# EAGLE design auxiliary (EAGLE 9.1.0)
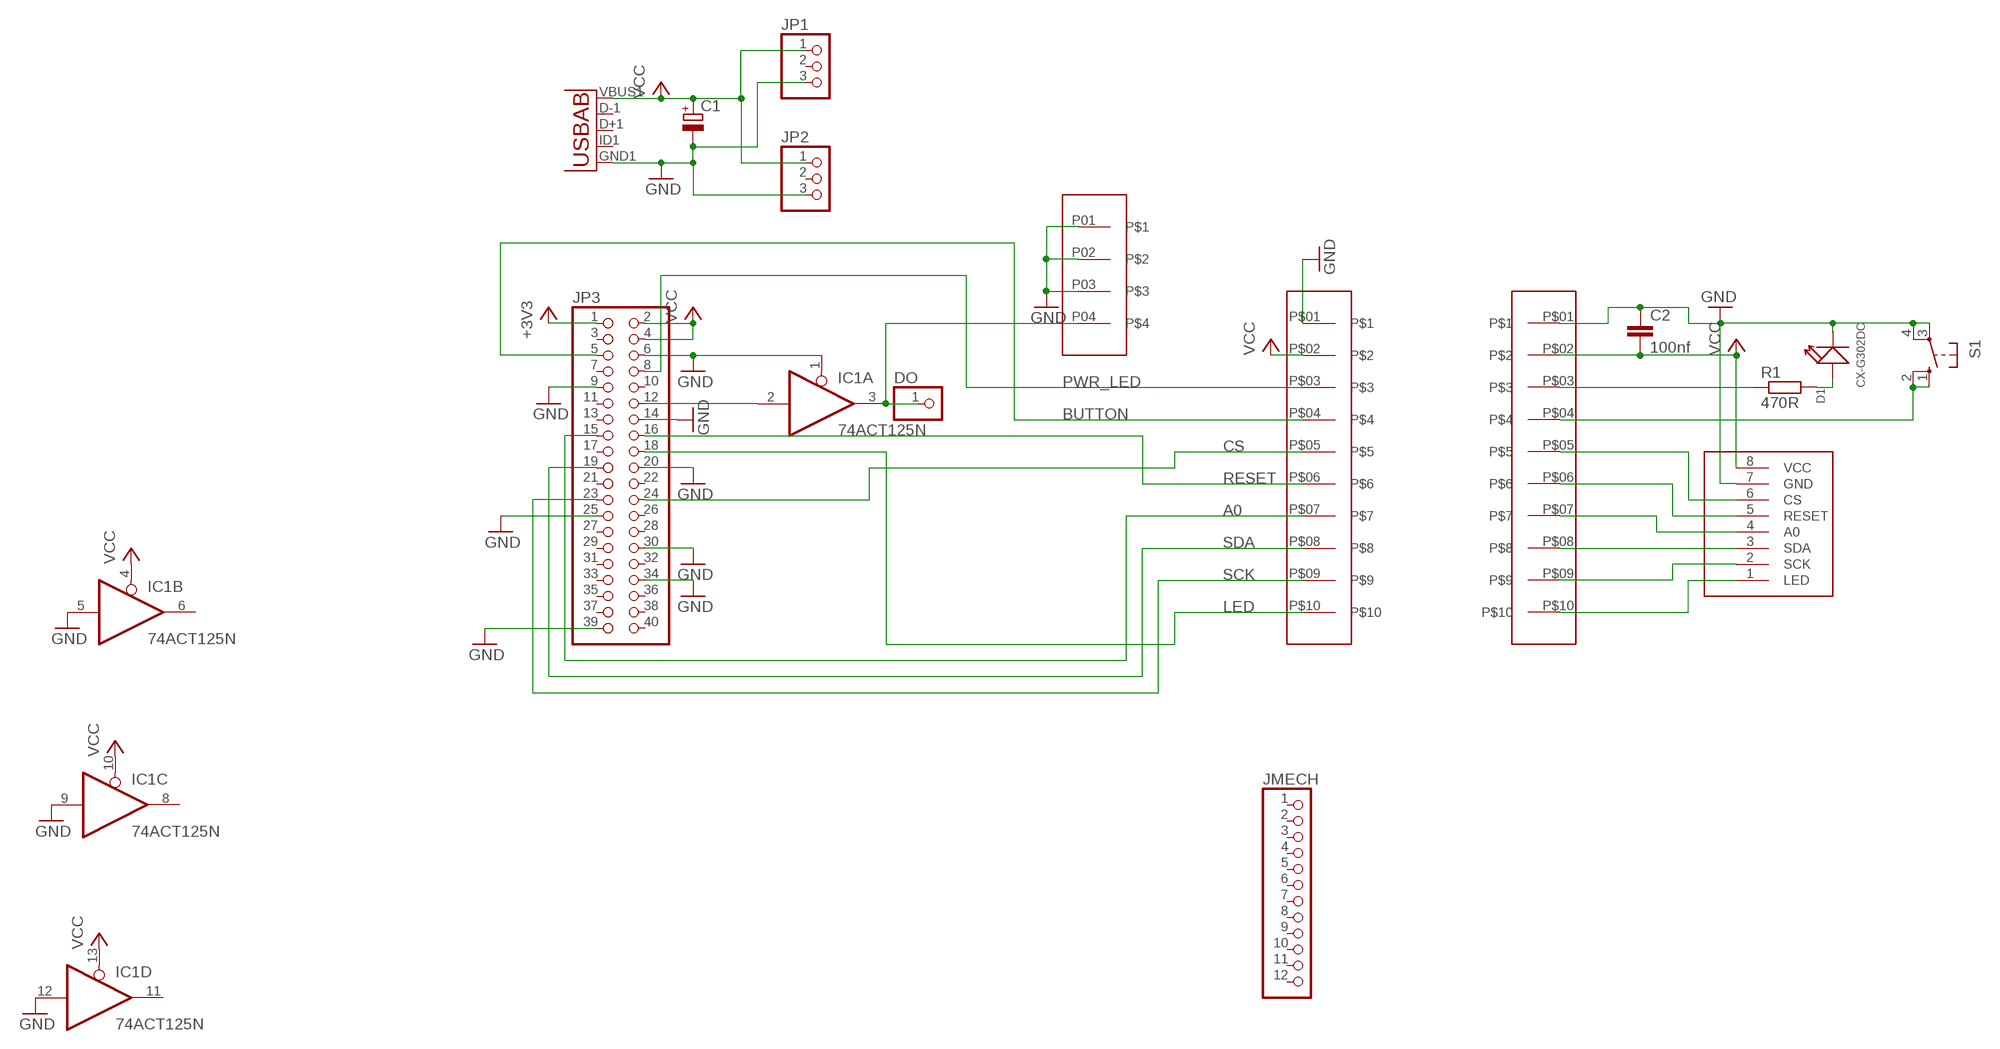
[diagram p0: schematic, sheet 1]

## Parts
C1  CPOL-EUE5-10.5  [E5-10,5]
C2  100nf  C-EU025-030X050  [C025-030X050]
D1  CX-G302DC  DIP-LED-GREEN-GREEN(2P-D3MM)  [LED2-2.54-D3.0MM]
DO  PINHD-1X1  [1X01]
IC1  74ACT125N  [DIL14]
J1  JST1.25_10PIN  [JST1.25_10PIN]
J2  JST1.25_10PIN  [JST1.25_10PIN]
JMECH  PINHD-1X12  [1X12]
JP1  PINHD-1X3  [1X03]
JP2  PINHD-1X3  [1X03]
JP3  PINHD-2X20  [2X20]
R1  470R  R-EU_0207/7  [0207/7]
S1  10-XX  [B3F-10XX]
U1  USB-THROUGH  [USB-MICRO-THROUGH]
U$2  SPI_TFT_1.44"  [SPI_TFT_1.44"]
U$3  JST1.25_4PIN  [JST1.25_4PIN]

## Nets
+3V3: JP3.1
A0: J1.P$07 JP3.15
BUTTON: J1.P$04 JP3.5
CS: J1.P$05 JP3.24
GND: C1.- C2.1 D1.K(-) IC1.1(A:OE) IC1.5(B:I) IC1.9(C:I) IC1.12(D:I) J1.P$01 J2.P$01 JP1.3 JP2.3 JP3.6 JP3.9 JP3.14 JP3.20 JP3.25 JP3.30 JP3.34 JP3.39 S1.3(P) S1.4(P1) U1.GND1(GND) U$2.7(GND) U$3.P01 U$3.P02 U$3.P03
LED: J1.P$10 JP3.18
N$1: D1.A(+) R1.2
N$3: DO.1 IC1.3(A:O) U$3.P04
N$4: IC1.2(A:I) JP3.12
N$5: J2.P$05 U$2.6(CS)
N$6: J2.P$06 U$2.5(RESET)
N$7: J2.P$07 U$2.4(A0)
N$8: J2.P$08 U$2.3(SDA)
N$9: J2.P$09 U$2.2(SCK)
N$10: J2.P$03 R1.1
N$11: J2.P$10 U$2.1(LED)
N$13: J2.P$04 S1.1(S) S1.2(S1)
PWR_LED: J1.P$03 JP3.8
RESET: J1.P$06 JP3.16
SCK: J1.P$09 JP3.23
SDA: J1.P$08 JP3.19
VCC: C1.+ C2.2 IC1.4(B:OE) IC1.10(C:OE) IC1.13(D:OE) J1.P$02 J2.P$02 JP1.1 JP2.1 JP3.2 JP3.4 U1.VBUS1(VBUS) U$2.8(VCC)
Unconnected: IC1.6(B:O) IC1.8(C:O) IC1.11(D:O) JMECH.1 JMECH.2 JMECH.3 JMECH.4 JMECH.5 JMECH.6 JMECH.7 JMECH.8 JMECH.9 JMECH.10 JMECH.11 JMECH.12 JP1.2 JP2.2 JP3.3 JP3.7 JP3.10 JP3.11 JP3.13 JP3.17 JP3.21 JP3.22 JP3.26 JP3.27 JP3.28 JP3.29 JP3.31 JP3.32 JP3.33 JP3.35 JP3.36 JP3.37 JP3.38 JP3.40 U1.D+1(D+) U1.D-1(D-) U1.ID1(USBID)

## Power pins joined to a net without a drawn wire
GND: IC1.7(P:GND)
VCC: IC1.14(P:VCC)

## Library data of the parts
C1 = rcl:CPOL-EU: POLARIZED CAPACITOR, European symbol; SPICEPREFIX: C
C2 = rcl:C-EU: CAPACITOR, European symbol; SPICEPREFIX: C
D1 = Seeed-LED:DIP-LED-GREEN-GREEN(2P-D3MM): 304090040; MPN: CX-G302DC
DO = pinhead:PINHD-1X1: PIN HEADER
IC1 = 74xx-eu:74*125: Quad bus BUFFER, 3-state
J1 J2 = jst_1.25:JST1.25_10PIN
JMECH = pinhead:PINHD-1X12: PIN HEADER
JP1 JP2 = pinhead:PINHD-1X3: PIN HEADER
JP3 = adafruit:PINHD-2X20: PIN HEADER
R1 = rcl:R-EU_: RESISTOR, European symbol; SPICEPREFIX: R
S1 = switch-omron:10-XX: OMRON SWITCH; MPN: B3F-1000; OC_FARNELL: 176432; OC_NEWARK: 36M3542
U1 = MicroUSB:USB: This is a USB AB connector that is compatible with USB OTG. i.e. this connector can serve as a host or device
U$2 = spi_tft:SPI_TFT_1.44"
U$3 = jst_1.25:JST1.25_4PIN

## Board
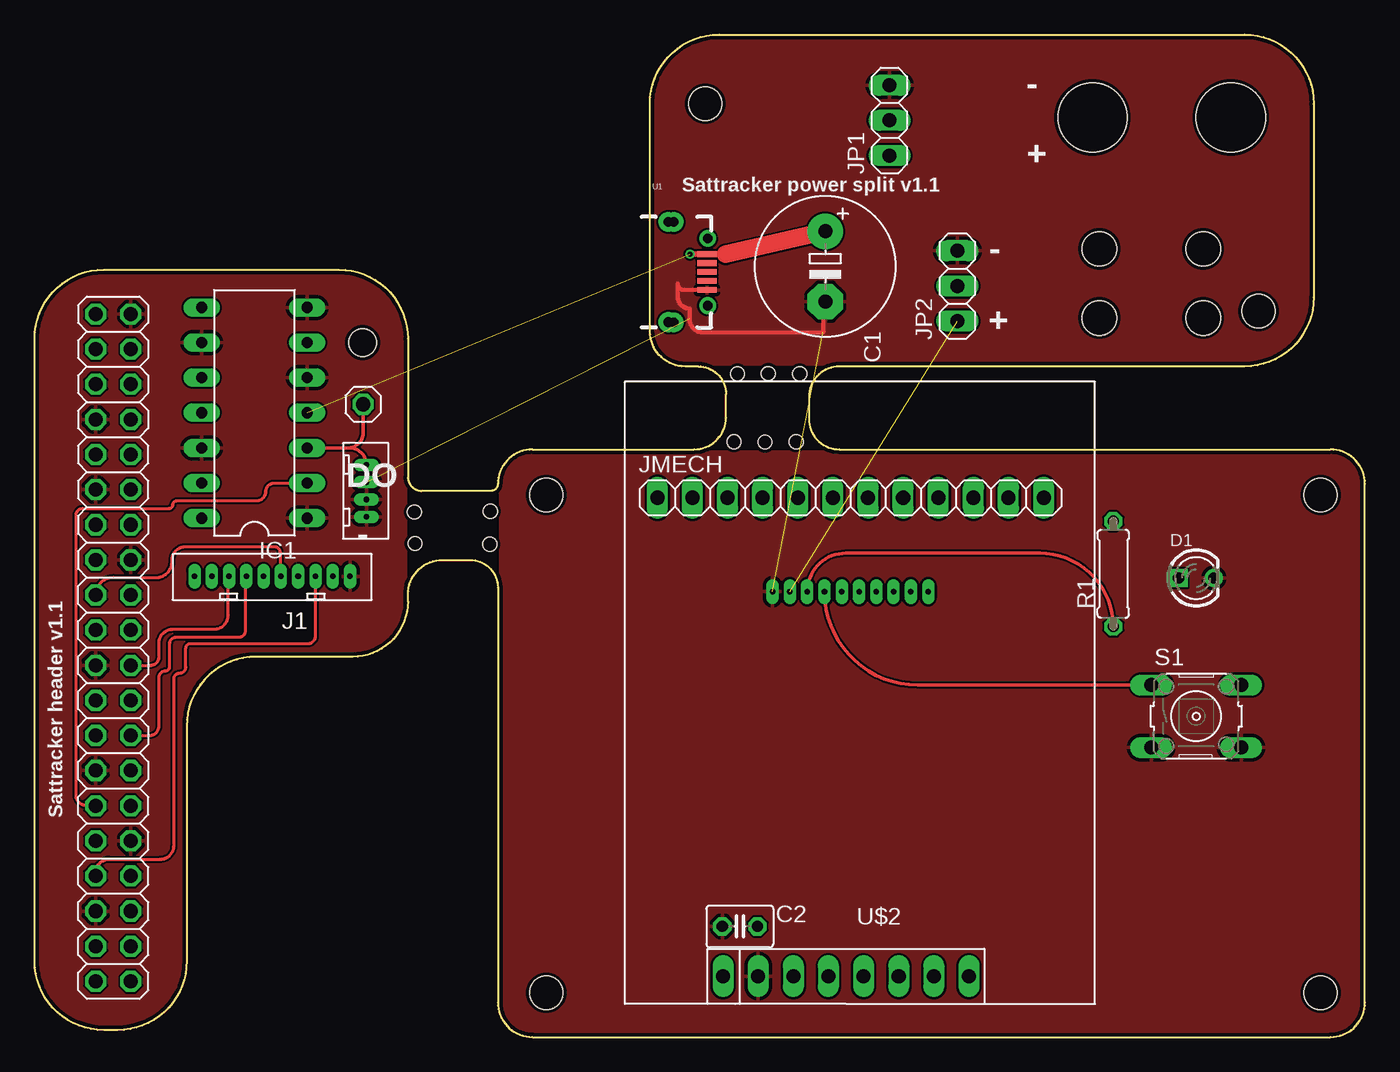
[diagram p1: board, top side]
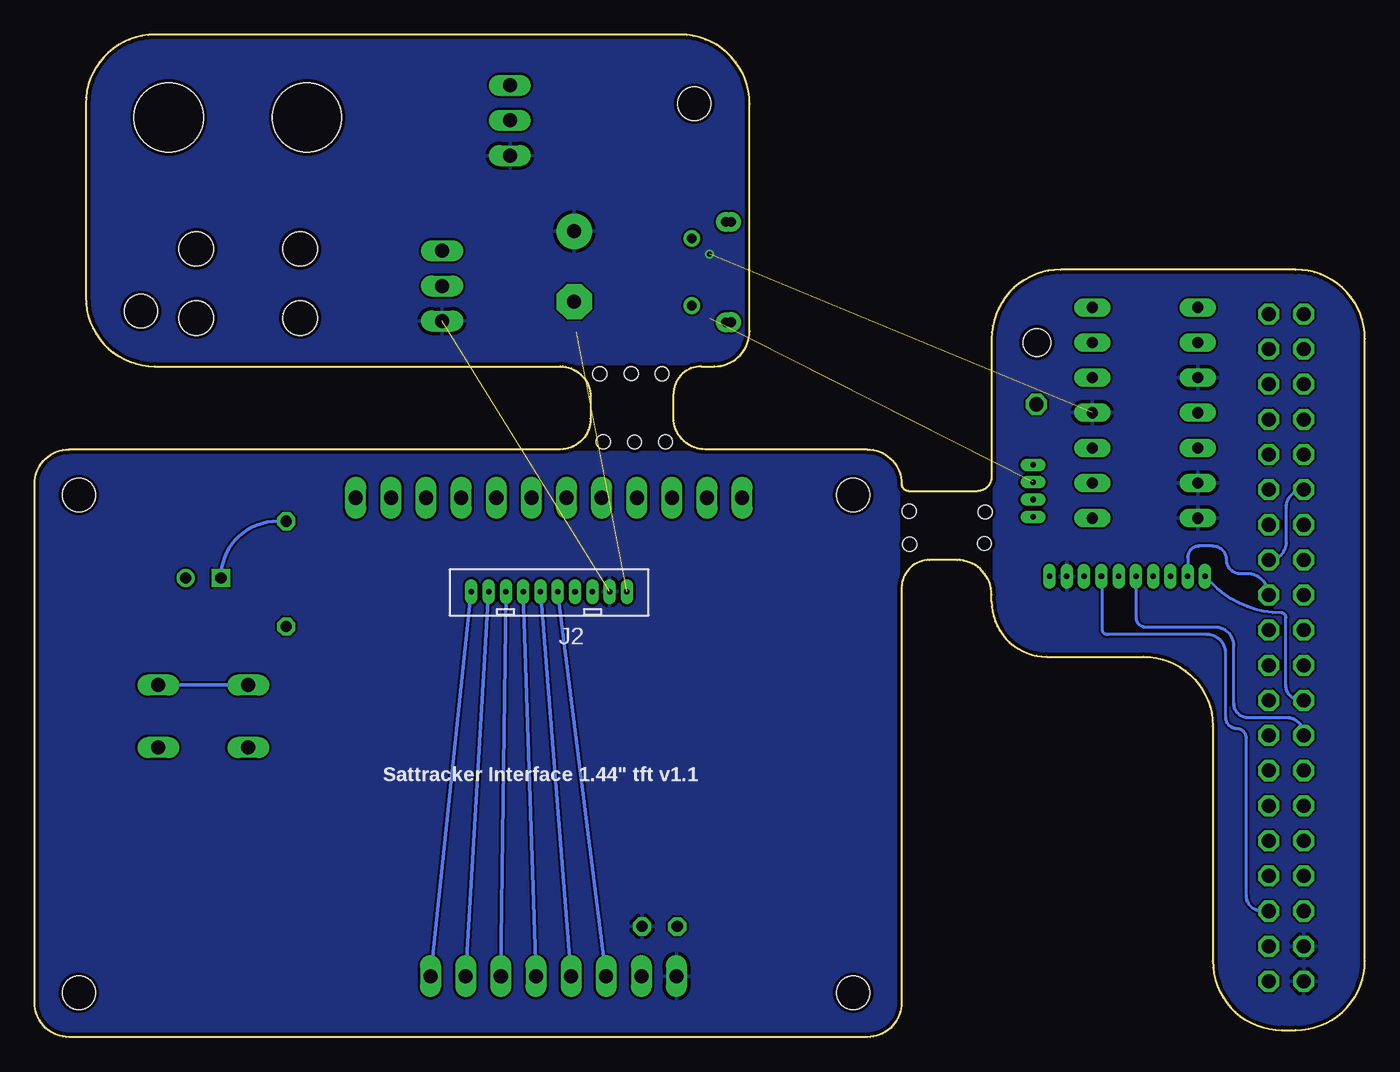
[diagram p2: board, bottom side, seen from below]

Size 96.2 x 72.5 mm. Coordinates in mm from the lower left corner, seen from the top.
Outline: 5,0.5 arc-90 0,5.5 0,50.5 arc-90 5,55.5 22,55.5 arc-90 27,50.5 27,40.5 arc90 28,39.5 33,39.5 arc90 33.5,40 arc-90 36,42.5 47.7,42.5 arc90 50,44.8 50,46.5 arc90 48,48.5 47.04,48.5 arc-90 44.5,51.04 44.5,67.5 arc-90 49.5,72.5 87.5,72.5 arc-90 92.5,67.5 92.5,53.5 arc-90 87.5,48.5 58.2,48.5 arc90 56,46.3 56,44.7 arc90 58.2,42.5 93.7,42.5 arc-90 96.2,40 96.2,2.5 arc-90 93.7,0 36,0 arc-90 33.5,2.5 33.5,32.5 arc90 31.5,34.5 29.5,34.5 arc90 27,32 27,31.5 arc-90 23,27.5 16,27.5 arc90 11,22.5 11,5.5 arc-90 6,0.5 5,0.5
Copper layers (1*16): Top 0.035mm / dielectric 1.5mm / Bottom 0.035mm
Design rules "SeeedStudio_2layer_DRU_no_angle_20140221": minimum track width 6mil, minimum drill 12mil, track to track 6mil, track to pad 6mil, pad to pad 6mil, via to via 6mil, smd to smd 0mil, copper to edge 10mil, drill to drill 10mil, minimum pad ring 10mil, minimum via ring 6mil, stop-mask expansion 2mil, vias tented up to drill 100mil, thermal gap 10mil
Holes 2 mm at 23.72,50.23
Holes 2.4 mm at 37,39.2 37,3.2 93,3.2 93,39.2 48.5,67.5 88.5,52.5
Holes 5 mm at 86.5,66.5 76.5,66.5
Holes 2.5 mm at 77,57 84.5,57 77,52 84.5,52
Holes 1 mm at 55.07,43.05 52.82,43.04 50.57,43.05 55.33,47.96 53.06,47.98 50.83,47.96 32.92,35.64 32.96,38.03 27.53,35.69 27.46,37.98

### Footprints (pad centres in the part's own frame; a part is rotated, then mirrored left to right if it is on the bottom)
E5-10,5 = drill 1.016 pad 2.54: + -2.54,0 | drill 1.016 pad 2.54 octagon: - 2.54,0
C025-030X050 = drill 0.813 octagon: 1 -1.27,0; 2 1.27,0
LED2-2.54-D3.0MM = drill 0.813 square: A -1.27,0 | drill 0.813: K 1.27,0
1X01 = drill 1.016 octagon: 1 0,0
DIL14 = drill 0.813 long: 1 -7.62,-3.81; 2 -5.08,-3.81; 3 -2.54,-3.81; 4 0,-3.81; 5 2.54,-3.81; 6 5.08,-3.81; 7 7.62,-3.81; 8 7.62,3.81; 9 5.08,3.81; 10 2.54,3.81; 11 0,3.81; 12 -2.54,3.81; 13 -5.08,3.81; 14 -7.62,3.81
JST1.25_10PIN = drill 0.4 pad 0.813 long: P$01 -5.625,0; P$02 -4.375,0; P$03 -3.125,0; P$04 -1.875,0; P$05 -0.625,0; P$06 0.625,0; P$07 1.875,0; P$08 3.125,0; P$09 4.375,0; P$10 5.625,0
1X12 = drill 1.016 long: 1 -13.97,0; 2 -11.43,0; 3 -8.89,0; 4 -6.35,0; 5 -3.81,0; 6 -1.27,0; 7 1.27,0; 8 3.81,0; 9 6.35,0; 10 8.89,0; 11 11.43,0; 12 13.97,0
1X03 = drill 1.016 long: 1 -2.54,0; 2 0,0; 3 2.54,0
2X20 = drill 1.016 octagon: 1 -24.13,-1.27; 2 -24.13,1.27; 3 -21.59,-1.27; 4 -21.59,1.27; 5 -19.05,-1.27; 6 -19.05,1.27; 7 -16.51,-1.27; 8 -16.51,1.27; 9 -13.97,-1.27; 10 -13.97,1.27; 11 -11.43,-1.27; 12 -11.43,1.27; 13 -8.89,-1.27; 14 -8.89,1.27; 15 -6.35,-1.27; 16 -6.35,1.27; 17 -3.81,-1.27; 18 -3.81,1.27; 19 -1.27,-1.27; 20 -1.27,1.27; 21 1.27,-1.27; 22 1.27,1.27; 23 3.81,-1.27; 24 3.81,1.27; 25 6.35,-1.27; 26 6.35,1.27; 27 8.89,-1.27; 28 8.89,1.27; 29 11.43,-1.27; 30 11.43,1.27; 31 13.97,-1.27; 32 13.97,1.27; 33 16.51,-1.27; 34 16.51,1.27; 35 19.05,-1.27; 36 19.05,1.27; 37 21.59,-1.27; 38 21.59,1.27; 39 24.13,-1.27; 40 24.13,1.27
0207/7 = drill 0.813 octagon: 1 -3.81,0; 2 3.81,0
B3F-10XX = drill 1.016 long: 1 -3.251,2.261; 2 3.251,2.261; 3 -3.251,-2.261; 4 3.251,-2.261
USB-MICRO-THROUGH = smd 1.4 x 0.4: D+1 2.7,0; D-1 2.7,0.65; GND1 2.7,-1.3; ID1 2.7,-0.65; VBUS1 2.7,1.3 | drill 0.7 pad 1.422: P$1 -0.1,3.63; P$2 0.3,3.625; P$3 -0.1,-3.62; P$4 0.3,-3.625 | drill 0.7: P$5 2.75,2.43; P$6 2.75,-2.425
SPI_TFT_1.44" = drill 1.016 long: 1 -8.89,0; 2 -6.35,0; 3 -3.81,0; 4 -1.27,0; 5 1.27,0; 6 3.81,0; 7 6.35,0; 8 8.89,0
JST1.25_4PIN = drill 0.4 pad 0.813 long: P01 -1.875,0; P02 -0.625,0; P03 0.625,0; P04 1.875,0

### Placement (x,y rotation side)
C1  57.17,55.73 270 top
C2  51,8 0 top
D1  84,33.2 0 top
DO  23.75,45.76 0 top
IC1  15.9,45.15 90 top
J1  17.19,33.32 180 top
J2  58.99,32.21 180 bottom
JMECH  59,39 0 top
JP1  61.83,66.29 90 top
JP2  66.73,54.32 90 top
JP3  5.69,28.16 90 top
R1  78,33.5 90 top
S1  84,23.2 0 top
U1  45.92,55.32 0 top
U$2  58.68,4.4 180 top
U$3  24,39.5 90 top

### Tracks (layer width: path | path; a pad name or v marks a point on that pad's centre or on a via)
A0
  Top 0.2: JP3.15 8.31,21.81 arc90 9,22.5 9,26.02 arc-90 9.47,26.49 arc90 9.77,26.79 9.77,28.45 arc-90 10.23,28.92 14.78,28.92 arc90 15.26,29.4 15.26,33.27 arc-90 J1.P$07
BUTTON
  Bottom 0.2: J1.P$04 arc90 19,33.27 19,29.5 arc-90 18.61,29.11 11.42,29.11 arc90 10.06,27.75 10.06,24.5 10.06,23.12 arc-90 9.23,22.29 arc90 8.57,21.64 8.57,10.23 arc-90 7.45,9.11 JP3.5
CS
  Top 0.2: JP3.24 arc-90 5.69,33.24 arc90 5.7,33.23 8.77,33.23 arc90 9.95,34.41 9.95,34.51 arc-90 10.92,35.48 17.32,35.48 arc-90 17.75,35.03 17.75,33.38 arc90 J1.P$05
GND  (2 unrouted)
  Top 0.305: U1.GND1 46.98,54.02 arc-90 46.5,54.5 46.5,53.55 arc90 47.34,52.7 47.34,51.96 arc90 48.33,50.97 57.01,50.97 arc90 57.06,51.01 57.06,53.07 arc-90 C1.-
  Bottom 0.2: JP3.25 arc-90 5.68,35.79 5.68,38.33 arc90 JP3.30
  pour Top: -8,80 -8,-14 arc90 -5.5,-16.5 103,-16.5 103,80
KEEPOUT
  cutout Top (rank 2): 47,48.5 60,48.5 60,42.5 48,42.5 arc-90 47,43.5
KEEPOUT2
  cutout Bottom: 47,48.5 60,48.5 60,42.5 47,42.5
KEEPOUT3
  cutout Bottom: 27,40.5 27,32.5 arc90 27.2,32.3 33.5,32.3 33.5,40.8 arc-90 33.2,40.5
KEEPOUT4
  cutout Top: 27,41.5 27,31.5 33.5,31.5 33.5,42.5 arc-90 32.4,41.4 arc90 32.3,41.5
LED
  Bottom 0.2: JP3.18 4.62,24.35 arc90 5.72,25.46 5.72,30.34 arc90 5.71,30.35 arc-90 6.04,30.68 arc42 10.68,32.44 J1.P$10
N$1
  Bottom 0.254: R1.2 78.62,37.31 arc-90 D1.A
N$3
  Top 0.254: U$3.P04 arc90 22.77,42.61 IC1.3 22.64,42.61 arc90 23.77,43.73 23.77,45.74 arc90 DO.1
N$4
  Top 0.2: JP3.12 3.77,16.73 arc-90 3,17.5 3,37.76 arc-90 3.46,38.23 9.73,38.23 arc90 10,38.5 arc-90 10.29,38.79 16.04,38.79 arc90 16.72,39.47 arc-90 17.32,40.07 IC1.2
N$5
  Bottom 0.254: J2.P$05 U$2.6
N$6
  Bottom 0.254: J2.P$06 U$2.5
N$7
  Bottom 0.254: J2.P$07 U$2.4
N$8
  Bottom 0.254: J2.P$08 U$2.3
N$9
  Bottom 0.254: J2.P$09 U$2.2
N$10
  Top 0.254: J2.P$03 arc-90 58.66,35 72.69,35 arc-90 R1.1
  Bottom 0.254: 77.81,29.5 R1.1
N$11
  Bottom 0.254: J2.P$10 U$2.1
N$13
  Top 0.254: J2.P$04 arc90 63.87,25.46 S1.1
  Bottom 0.254: 80.71,25.5 arc-90 S1.1 S1.2
PWR_LED
  Top 0.2: JP3.8 4.42,11.91 arc-90 5.37,12.86 9.08,12.86 arc90 10.08,13.86 10.08,25.93 arc-90 10.47,26.32 arc90 10.95,26.79 10.95,28.14 arc-90 11.27,28.46 19.79,28.46 arc90 20.31,28.99 J1.P$03
RESET
  Bottom 0.2: JP3.16 4.42,21.89 arc-90 5.62,23.08 8.44,23.08 arc90 9.47,24.12 9.47,28.29 arc-90 10.82,29.63 15.85,29.63 arc90 16.52,30.3 16.52,33.29 arc-90 J1.P$06
SCK
  Bottom 0.2: JP3.23 arc-90 8.49,33.5 9,33.5 arc90 10,34.5 arc-90 11,35.5 12,35.5 arc-90 12.81,34.69 J1.P$09
SDA
  Top 0.2: JP3.19 8.39,26.89 arc90 9,27.5 9,28.5 arc-90 10,29.5 13,29.5 arc90 14,30.5 14,33.27 arc-90 J1.P$08
VCC  (via drill 0.35)  (3 unrouted)
  Top 0.406: v47.4,56.62 U1.VBUS1 arc-90 U1.VBUS1 arc90 U1.VBUS1 49.97,56.62
  Top 1.27: 49.97,56.62 C1.+
  pour Bottom: -5,115.5 -5,-7.5 94.5,-7.5 arc90 109,7 109,113.5 -3,113.5 arc-90

### Text on the board
tPlace: - | + | Sattracker power split v1.1 | - | + | DO | - | Sattracker header v1.1
bPlace: Sattracker Interface 1.44" tft v1.1